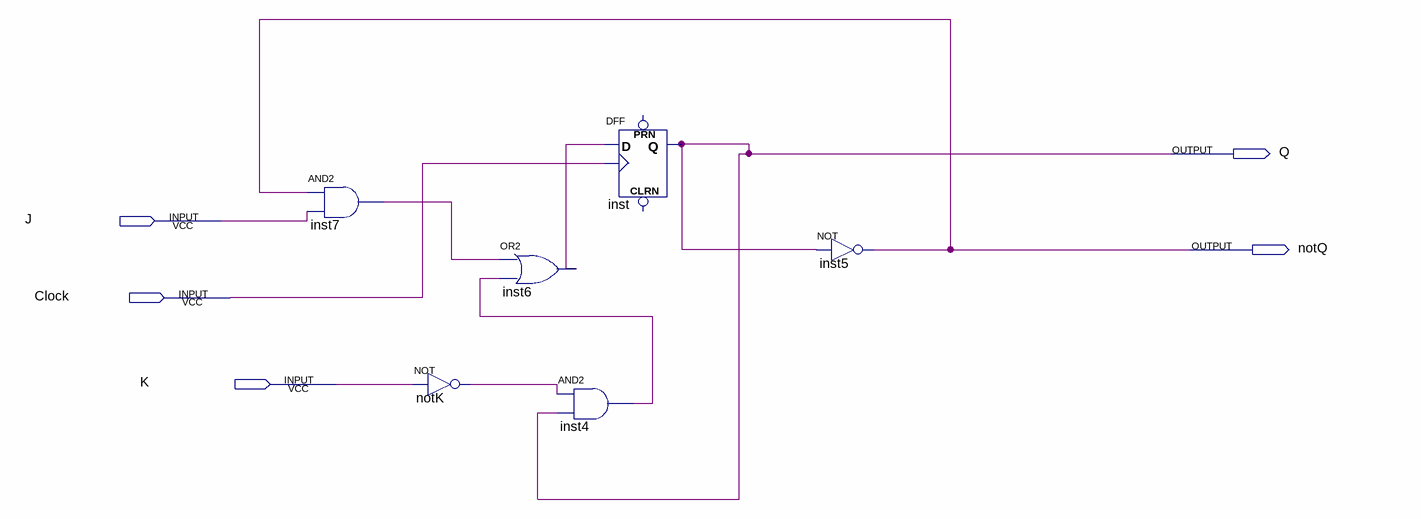
[diagram p0: schematic sheet]
// Quartus schematic part3.bdf as structural Verilog: 6 symbols, 5 pins
module part3 (
  input  J,
  input  Clock,
  input  K,
  output Q,
  output notQ
);

  wire inst4_out, inst6_out, inst7_out, notK_out;

  and inst7 (inst7_out, notQ, J);
  not notK (notK_out, K);
  or inst6 (inst6_out, inst7_out, inst4_out);
  DFF inst (.CLK(Clock), .D(inst6_out), .Q(Q));  // open: CLRN, PRN
  and inst4 (inst4_out, notK_out, Q);
  not inst5 (notQ, Q);
endmodule
